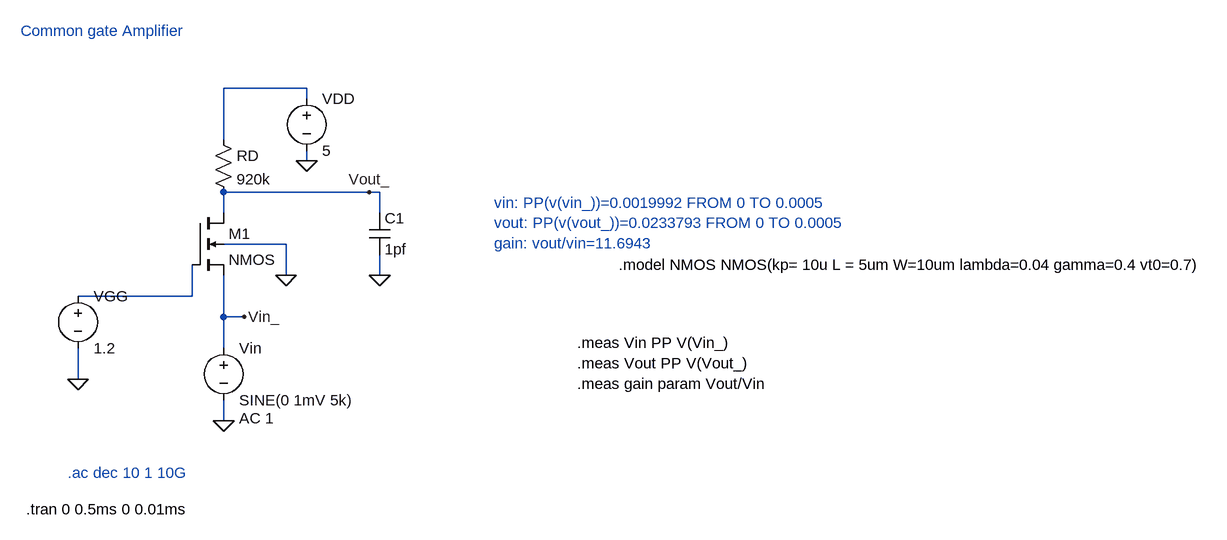
[diagram p0: schematic Common_gate_amplifier.asc]
Common_gate_amplifier.asc, the LTspice schematic file:
Version 4
SHEET 1 1840 1244
WIRE 256 -80 128 -80
WIRE 256 -64 256 -80
WIRE 128 0 128 -80
WIRE 256 32 256 16
WIRE 352 80 128 80
WIRE 368 80 352 80
WIRE 128 112 128 80
WIRE 368 112 368 80
WIRE 224 160 128 160
WIRE 224 208 224 160
WIRE 368 208 368 176
WIRE 80 240 80 192
WIRE 80 240 -96 240
WIRE 128 272 128 208
WIRE 160 272 128 272
WIRE 128 320 128 272
WIRE -96 368 -96 320
WIRE 128 432 128 400
FLAG 128 432 0
FLAG -96 368 0
FLAG 224 208 0
FLAG 256 32 0
FLAG 160 272 Vin_
FLAG 368 208 0
FLAG 352 80 Vout_
SYMBOL nmos4 80 112 R0
SYMATTR InstName M1
SYMBOL res 112 -16 R0
SYMATTR InstName RD
SYMATTR Value 920k
SYMBOL voltage -96 224 R0
WINDOW 123 0 0 Left 0
WINDOW 39 0 0 Left 0
SYMATTR InstName VGG
SYMATTR Value 1.2
SYMBOL voltage 128 304 R0
WINDOW 123 24 124 Left 2
WINDOW 39 0 0 Left 0
SYMATTR Value2 AC 1
SYMATTR InstName Vin
SYMATTR Value SINE(0 1mV 5k)
SYMBOL voltage 256 -80 R0
WINDOW 123 0 0 Left 0
WINDOW 39 0 0 Left 0
SYMATTR InstName VDD
SYMATTR Value 5
SYMBOL cap 352 112 R0
SYMATTR InstName C1
SYMATTR Value 1pf
TEXT 736 192 Left 2 !.model NMOS NMOS(kp= 10u L = 5um W=10um lambda=0.04 gamma=0.4 vt0=0.7)
TEXT -112 512 Left 2 ;.ac dec 10 1 10G
TEXT -176 568 Left 2 !.tran 0 0.5ms 0 0.01ms
TEXT 672 312 Left 2 !.meas Vin PP V(Vin_)\n.meas Vout PP V(Vout_)\n.meas gain param Vout/Vin
TEXT 544 96 Left 2 ;vin: PP(v(vin_))=0.0019992 FROM 0 TO 0.0005\nvout: PP(v(vout_))=0.0233793 FROM 0 TO 0.0005\ngain: vout/vin=11.6943
TEXT -184 -168 Left 2 ;Common gate Amplifier

The netlist it stands for:
* Common_gate_amplifier.asc
M1 Vout_ N002 Vin_ 0 NMOS
RD N001 Vout_ 920k
VGG N002 0 1.2
Vin Vin_ 0 SINE(0 1mV 5k) AC 1
VDD N001 0 5
C1 Vout_ 0 1pf
.model NMOS NMOS
.model PMOS PMOS
.lib standard.mos
.model NMOS NMOS(kp= 10u L = 5um W=10um lambda=0.04 gamma=0.4 vt0=0.7)
* .ac dec 10 1 10G
.tran 0 0.5ms 0 0.01ms
.meas Vin PP V(Vin_)
.meas Vout PP V(Vout_)
.meas gain param Vout/Vin
* vin: PP(v(vin_))=0.0019992 FROM 0 TO 0.0005
* vout: PP(v(vout_))=0.0233793 FROM 0 TO 0.0005
* gain: vout/vin=11.6943
* Common gate Amplifier
.backanno
.end